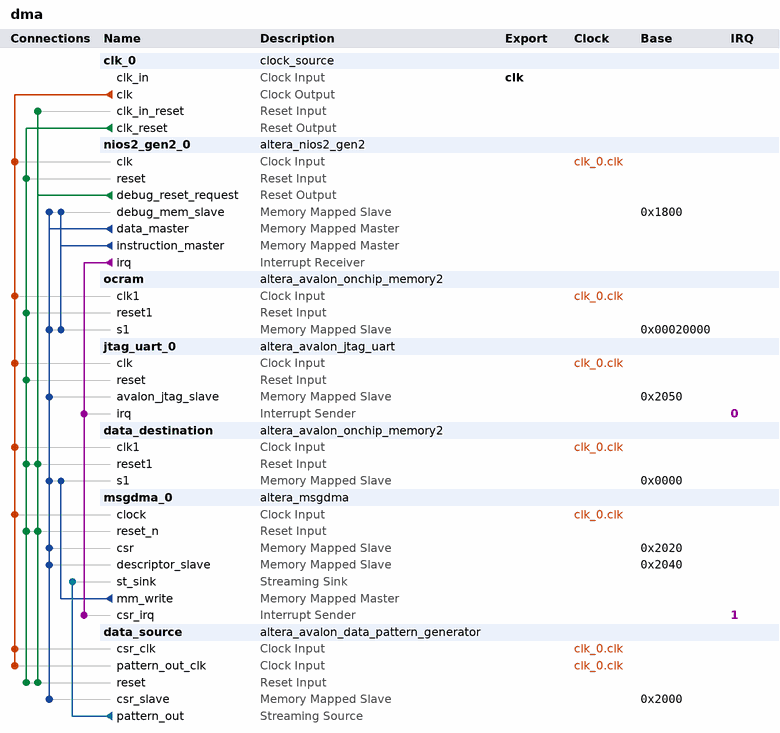
[diagram p0: system contents]
# Platform Designer (Qsys) system dma, MAX 10 10M50DAF484C6GES
# Parameters at their usual value, and those the tool derives, are not listed.
package require -exact qsys 22.1
create_system dma
set_project_property DEVICE_FAMILY {MAX 10}
set_project_property DEVICE 10M50DAF484C6GES

add_instance clk_0 clock_source 22.1
set_instance_parameter_value clk_0 clockFrequency 50000000

add_instance nios2_gen2_0 altera_nios2_gen2 22.1
set_instance_parameter_value nios2_gen2_0 dcache_size 2048
set_instance_parameter_value nios2_gen2_0 exceptionSlave ocram.s1
set_instance_parameter_value nios2_gen2_0 icache_size 4096
set_instance_parameter_value nios2_gen2_0 impl Fast
set_instance_parameter_value nios2_gen2_0 resetSlave ocram.s1

add_instance ocram altera_avalon_onchip_memory2 22.1
set_instance_parameter_value ocram dataWidth 32
set_instance_parameter_value ocram dualPort false
set_instance_parameter_value ocram initMemContent true
set_instance_parameter_value ocram initializationFileName onchip_mem.hex
set_instance_parameter_value ocram memorySize 40960

add_instance jtag_uart_0 altera_avalon_jtag_uart 22.1
set_instance_parameter_value jtag_uart_0 simInteractiveOptions NO_INTERACTIVE_WINDOWS

add_instance data_destination altera_avalon_onchip_memory2 22.1
set_instance_parameter_value data_destination allowInSystemMemoryContentEditor true
set_instance_parameter_value data_destination dataWidth 32
set_instance_parameter_value data_destination dualPort false
set_instance_parameter_value data_destination initMemContent true
set_instance_parameter_value data_destination initializationFileName onchip_mem.hex
set_instance_parameter_value data_destination instanceID MEM
set_instance_parameter_value data_destination memorySize 4096

add_instance msgdma_0 altera_msgdma 22.1
set_instance_parameter_value msgdma_0 BURST_ENABLE 0
set_instance_parameter_value msgdma_0 DATA_FIFO_DEPTH 64
set_instance_parameter_value msgdma_0 DATA_WIDTH 32
set_instance_parameter_value msgdma_0 DESCRIPTOR_FIFO_DEPTH 128
set_instance_parameter_value msgdma_0 ENHANCED_FEATURES 0
set_instance_parameter_value msgdma_0 ERROR_ENABLE 0
set_instance_parameter_value msgdma_0 MAX_BURST_COUNT 2
set_instance_parameter_value msgdma_0 MAX_BYTE 1024
set_instance_parameter_value msgdma_0 MODE 2
set_instance_parameter_value msgdma_0 PACKET_ENABLE 0
set_instance_parameter_value msgdma_0 TRANSFER_TYPE {Aligned Accesses}

add_instance data_source altera_avalon_data_pattern_generator 22.1
set_instance_parameter_value data_source AVALON_ENABLED true
set_instance_parameter_value data_source BYPASS_ENABLED false
set_instance_parameter_value data_source CROSS_CLK_SYNC_DEPTH 2
set_instance_parameter_value data_source FREQ_CNTER_ENABLED false
set_instance_parameter_value data_source ST_DATA_W 32

# connections
add_connection clk_0.clk data_destination.clk1 clock
add_connection clk_0.clk data_source.csr_clk clock
add_connection clk_0.clk data_source.pattern_out_clk clock
add_connection clk_0.clk jtag_uart_0.clk clock
add_connection clk_0.clk msgdma_0.clock clock
add_connection clk_0.clk nios2_gen2_0.clk clock
add_connection clk_0.clk ocram.clk1 clock
add_connection clk_0.clk_reset data_destination.reset1 reset
add_connection clk_0.clk_reset data_source.reset reset
add_connection clk_0.clk_reset jtag_uart_0.reset reset
add_connection clk_0.clk_reset msgdma_0.reset_n reset
add_connection clk_0.clk_reset nios2_gen2_0.reset reset
add_connection clk_0.clk_reset ocram.reset1 reset
add_connection nios2_gen2_0.debug_reset_request clk_0.clk_in_reset reset
add_connection nios2_gen2_0.debug_reset_request data_destination.reset1 reset
add_connection nios2_gen2_0.debug_reset_request data_source.reset reset
add_connection nios2_gen2_0.debug_reset_request msgdma_0.reset_n reset
add_connection msgdma_0.mm_write data_destination.s1 avalon
set_connection_parameter_value msgdma_0.mm_write/data_destination.s1 baseAddress 0x0000
add_connection nios2_gen2_0.data_master data_destination.s1 avalon
set_connection_parameter_value nios2_gen2_0.data_master/data_destination.s1 baseAddress 0x0000
add_connection nios2_gen2_0.data_master data_source.csr_slave avalon
set_connection_parameter_value nios2_gen2_0.data_master/data_source.csr_slave baseAddress 0x2000
add_connection nios2_gen2_0.data_master jtag_uart_0.avalon_jtag_slave avalon
set_connection_parameter_value nios2_gen2_0.data_master/jtag_uart_0.avalon_jtag_slave baseAddress 0x2050
add_connection nios2_gen2_0.data_master msgdma_0.csr avalon
set_connection_parameter_value nios2_gen2_0.data_master/msgdma_0.csr baseAddress 0x2020
add_connection nios2_gen2_0.data_master msgdma_0.descriptor_slave avalon
set_connection_parameter_value nios2_gen2_0.data_master/msgdma_0.descriptor_slave baseAddress 0x2040
add_connection nios2_gen2_0.data_master nios2_gen2_0.debug_mem_slave avalon
set_connection_parameter_value nios2_gen2_0.data_master/nios2_gen2_0.debug_mem_slave baseAddress 0x1800
add_connection nios2_gen2_0.data_master ocram.s1 avalon
set_connection_parameter_value nios2_gen2_0.data_master/ocram.s1 baseAddress 0x00020000
add_connection nios2_gen2_0.instruction_master nios2_gen2_0.debug_mem_slave avalon
set_connection_parameter_value nios2_gen2_0.instruction_master/nios2_gen2_0.debug_mem_slave baseAddress 0x1800
add_connection nios2_gen2_0.instruction_master ocram.s1 avalon
set_connection_parameter_value nios2_gen2_0.instruction_master/ocram.s1 baseAddress 0x00020000
add_connection data_source.pattern_out msgdma_0.st_sink avalon_streaming
add_connection nios2_gen2_0.irq jtag_uart_0.irq interrupt
set_connection_parameter_value nios2_gen2_0.irq/jtag_uart_0.irq irqNumber 0
add_connection nios2_gen2_0.irq msgdma_0.csr_irq interrupt
set_connection_parameter_value nios2_gen2_0.irq/msgdma_0.csr_irq irqNumber 1

# exported interfaces
add_interface clk clock sink
set_interface_property clk EXPORT_OF clk_0.clk_in

set_interconnect_requirement {$system} qsys_mm.clockCrossingAdapter HANDSHAKE
set_interconnect_requirement {$system} qsys_mm.enableEccProtection FALSE
set_interconnect_requirement {$system} qsys_mm.insertDefaultSlave FALSE
set_interconnect_requirement {$system} qsys_mm.maxAdditionalLatency 1

save_system dma.qsys
